# Altium schematic sheet Chov3_main.SchDoc
size A4; DocumentNumber: 1; SheetNumber: 1; SheetTotal: 3; LotOfPieces: 1
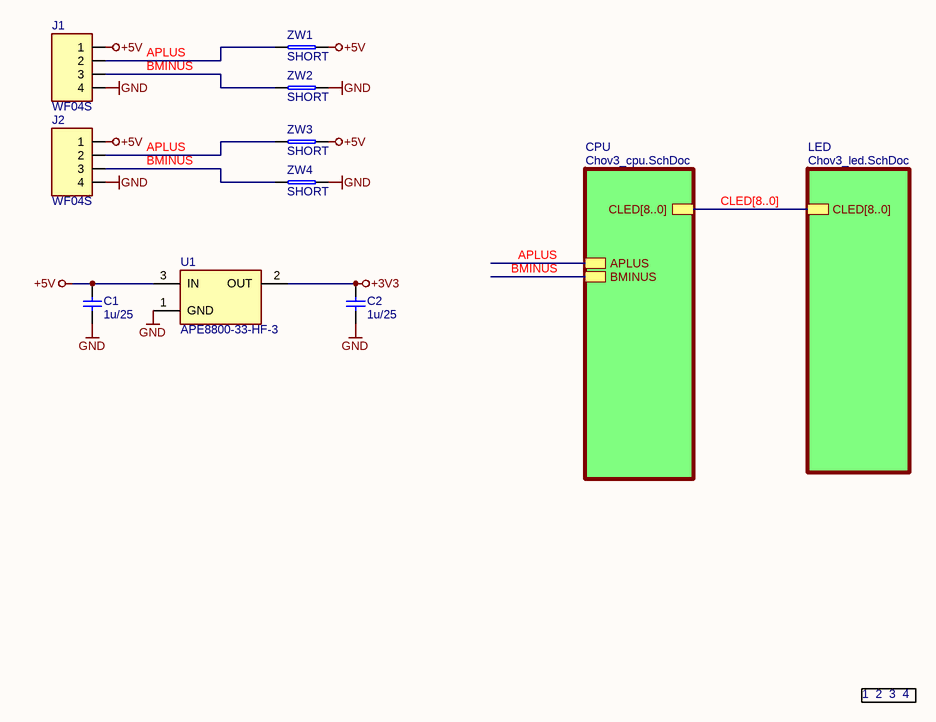
[diagram p0: Chov3_main.SchDoc]

## Parts
C1  OtherParams: 1u/25  [0805]  (hidden comment: CL21B105KAFNNNG)
C2  OtherParams: 1u/25  [0805]  (hidden comment: CL21B105KAFNNNG)
J1  WF04S  [WF04S]
J2  WF04S  [WF04S]
NUMBERS1  WARSTWYT_M1_M2_B  [WARSTWYT_M1_M2_B]  (value not drawn)  (no BOM)
U1  APE8800-33-HF-3  [SOT23-3]
ZW1  SHORT  [SHORT0805]
ZW2  SHORT  [SHORT0805]
ZW3  SHORT  [SHORT0805]
ZW4  SHORT  [SHORT0805]

## Sub-sheets
CPU = Chov3_cpu.SchDoc: CLED[8..0], APLUS, BMINUS
LED = Chov3_led.SchDoc: CLED[8..0]

## Nets
+3V3: C2.1 U1.2(OUT)
+5V: C1.1 J1.1 J2.1 U1.3(IN) ZW1.2 ZW3.2
GND: C1.2 C2.2 J1.4 J2.4 U1.1(GND) ZW2.2 ZW4.2
APLUS: J1.2 J2.2 ZW1.1 ZW3.1 ; sheet CPU/APLUS
BMINUS: J1.3 J2.3 ZW2.1 ZW4.1 ; sheet CPU/BMINUS

## Buses and harness runs
bus CLED[8..0] = sheet CPU/CLED[8..0] = sheet LED/CLED[8..0]

## Notes on the sheet
- Wariant:
- Rev.
- /
- Projekt i wykonanie: (C) Miroslaw Lach MRQ, www.mlach.com
- git:
- Page:
- Plik:
- (in symbol WARSTWYT_M1_M2_B[[/\]]WARSTWYT_M1_M2_B) 1; 2; 3; 4

## Library data of the parts
C1 C2 = CL21B105KAFNNNG[[/\]]0805[[/\]]25V[[/\]]10%[[/\]]1u/25: MaxVoltage: 25V; Tolerance: 10%; Descript: Kondensator: ceramiczny; MLCC; 1uF; 25V; X7R; ±10%; SMD; 0805; Currency5: PLN; Value: CL21B105KAFNNNG; Dimensions: 0805; Supplier5: tme.pl; Reference5: CL21B105KAFNNNG; Manufacturer5: Samsung; Typ5: CL21B105KAFNNNG; Price5: 0,051; DateOfPrice5: 2016-08-23
J1 J2 = WF04S[[/\]]WF04S: Descript: connector 2.54mm pitch, THT, 4 pole, straight, male; Currency5: PLN; Value: WF04S; Dimensions: WF04S; Supplier5: maritex.com.pl; Reference5: WF04S; Price5: 0,069; DateOfPrice5: 2015-01-26
NUMBERS1 = WARSTWYT_M1_M2_B[[/\]]WARSTWYT_M1_M2_B: Value: WARSTWYT_M1_M2_B; Dimensions: WARSTWYT_M1_M2_B
U1 = APE8800-33-HF-3[[/\]]SOT23-3: Descript: Low quiescent current LDO, 3.3V, 300mA, SOT-23; Reference5: APE8800N-33-HF-3; Currency5: PLN; Value: APE8800-33-HF-3; Dimensions: SOT23-3; Supplier5: tme.pl; Manufacturer5: Advanced Power Electronics; Typ5: APE8800N-33-HF-3; Price5: 1,3603; DateOfPrice5: 2015-12-27
ZW1-ZW4 = SHORT[[/\]]SHORT[[/\]]0[[/\]]1%[[/\]]SHORT0805: DissPower: 0; Tolerance: 1%; Currency5: PLN; Value: SHORT; OtherParams: SHORT0805; Dimensions: SHORT; Price5: 0; DateOfPrice5: 2016-12-14